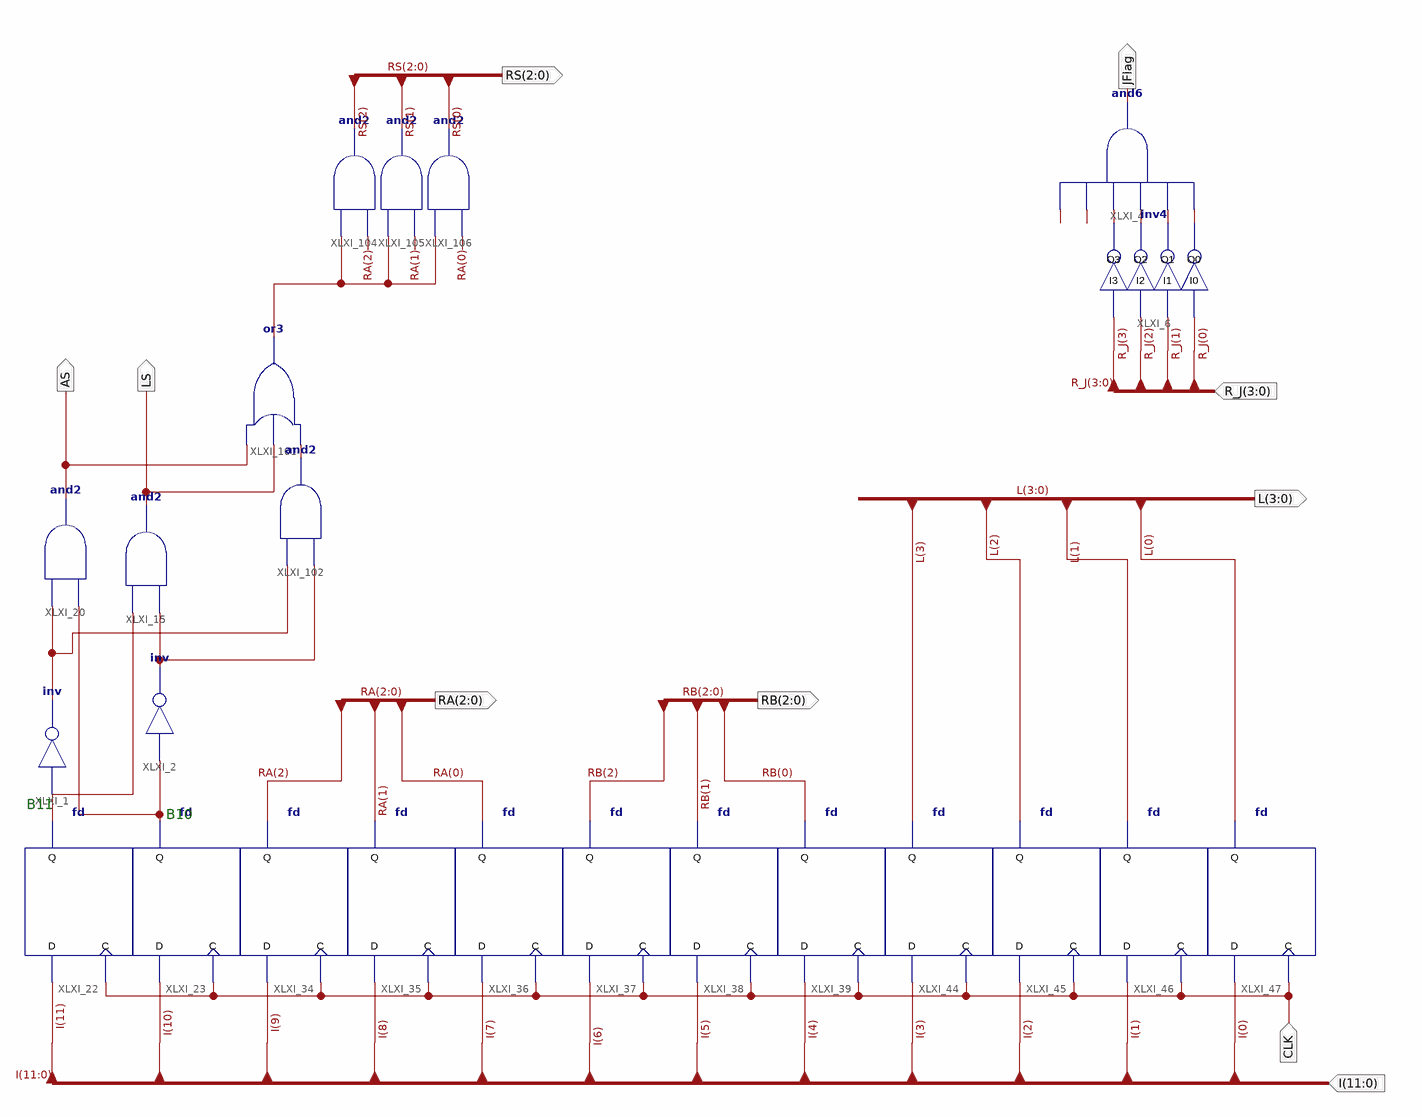
[diagram p0: schematic sheet 1]
// Xilinx ISE schematic Ins_Decoder.sch (spartan3e) as structural Verilog: 23 symbols, 10 ports
module Ins_Decoder (
  input  [11:0] I,
  input  CLK,
  input  [3:0] R_J,
  output [2:0] RB,
  output [2:0] RA,
  output AS,
  output LS,
  output [3:0] L,
  output [2:0] RS,
  output JFlag
);

  wire B10, B11, not10, not11, XLXN_25, XLXN_26, XLXN_27, XLXN_28, XLXN_204, XLXN_210;

  not XLXI_2 (not10, B10);
  not XLXI_1 (not11, B11);
  and XLXI_20 (AS, B10, not11);
  and XLXI_15 (LS, not10, B11);
  or XLXI_101 (XLXN_210, XLXN_204, LS, AS);
  and XLXI_102 (XLXN_204, not10, not11);
  and XLXI_105 (RS[1], RA[1], XLXN_210);
  and XLXI_106 (RS[0], RA[0], XLXN_210);
  and XLXI_104 (RS[2], RA[2], XLXN_210);
  fd XLXI_47 (.C(CLK), .D(I[0]), .Q(L[0]));
  fd XLXI_46 (.C(CLK), .D(I[1]), .Q(L[1]));
  fd XLXI_45 (.C(CLK), .D(I[2]), .Q(L[2]));
  fd XLXI_44 (.C(CLK), .D(I[3]), .Q(L[3]));
  fd XLXI_39 (.C(CLK), .D(I[4]), .Q(RB[0]));
  fd XLXI_38 (.C(CLK), .D(I[5]), .Q(RB[1]));
  fd XLXI_37 (.C(CLK), .D(I[6]), .Q(RB[2]));
  fd XLXI_36 (.C(CLK), .D(I[7]), .Q(RA[0]));
  fd XLXI_35 (.C(CLK), .D(I[8]), .Q(RA[1]));
  fd XLXI_34 (.C(CLK), .D(I[9]), .Q(RA[2]));
  fd XLXI_22 (.C(CLK), .D(I[11]), .Q(B11));
  fd XLXI_23 (.C(CLK), .D(I[10]), .Q(B10));
  inv4 XLXI_6 (
    .I0(R_J[0]), .I1(R_J[1]), .I2(R_J[2]), .I3(R_J[3]), .O0(XLXN_25), .O1(XLXN_26), .O2(XLXN_27), .O3(XLXN_28));
  and XLXI_4 (JFlag, XLXN_25, XLXN_26, XLXN_27, XLXN_28, B10, B11);

  // Notes on the sheet:
  //   B11
  //   B10
endmodule
